# Altium schematic sheet Power_Burn_wire.SchDoc
size A4; SheetNumber: 1; SheetTotal: 2
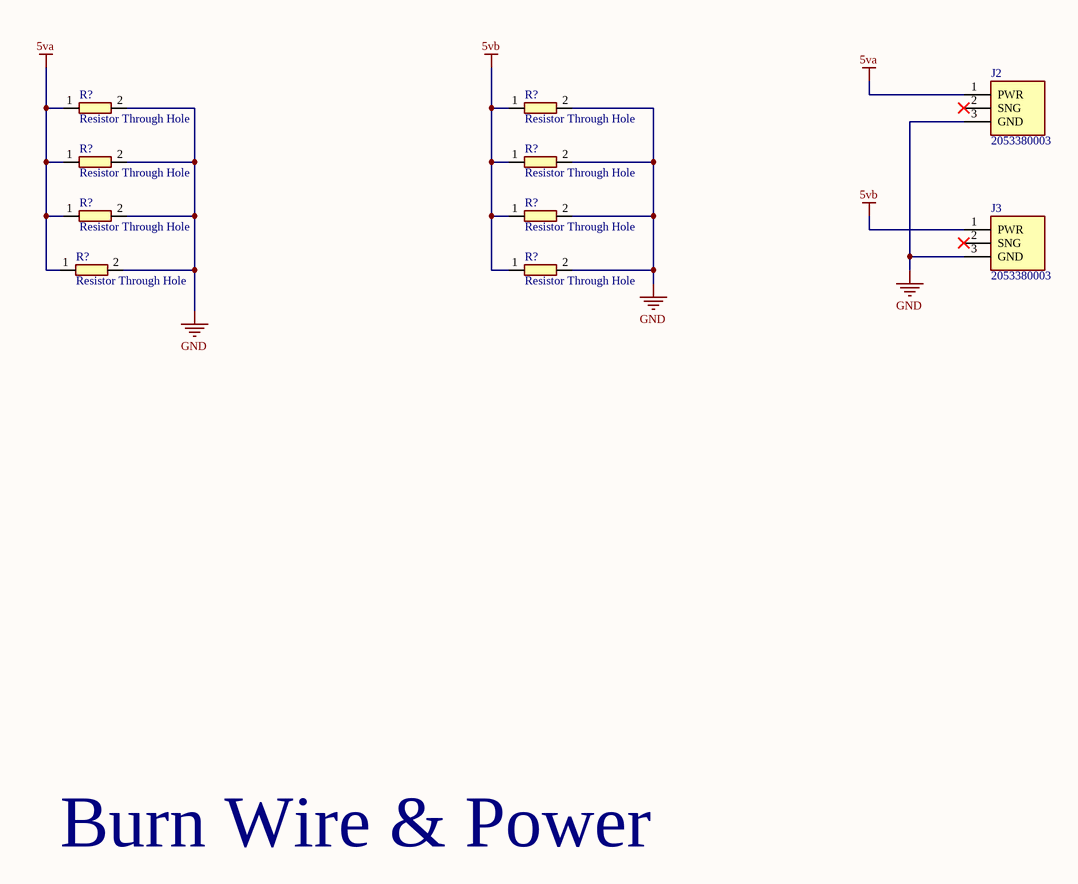
[diagram p0: Power_Burn_wire.SchDoc]

## Parts
(Parts that share a designator on the sheet are numbered #1, #2 ... from top to bottom, then left to right.)
J2  2053380003  [2053380003]
J3  2053380003  [2053380003]
R?#1  Resistor Through Hole  [ResistoR THROUGHHOLE]
R?#2  Resistor Through Hole  [ResistoR THROUGHHOLE]
R?#3  Resistor Through Hole  [ResistoR THROUGHHOLE]
R?#4  Resistor Through Hole  [ResistoR THROUGHHOLE]
R?#5  Resistor Through Hole  [ResistoR THROUGHHOLE]
R?#6  Resistor Through Hole  [ResistoR THROUGHHOLE]
R?#7  Resistor Through Hole  [ResistoR THROUGHHOLE]
R?#8  Resistor Through Hole  [ResistoR THROUGHHOLE]

## Nets
5va: J2.1(PWR) R?#1.1 R?#3.1 R?#5.1 R?#7.1
5vb: J3.1(PWR) R?#2.1 R?#4.1 R?#6.1 R?#8.1
GND: J2.3(GND) J3.3(GND) R?#1.2 R?#2.2 R?#3.2 R?#4.2 R?#5.2 R?#6.2 R?#7.2 R?#8.2

Not connected (* = marked no-connect by the designer): J2 2(SNG)*; J3 2(SNG)*

## Notes on the sheet
- Burn Wire & Power

## Library data of the parts
J2 J3 = 2053380003: Connector; Manufacturer_Name: Molex; Datasheet Link: https://www.molex.com/en-us/products/part-detail-pdf/2053380003?display=pdf; Height: 2.6mm; Manufacturer_Part_Number: 2053380003; Arrow Part Number: 2053380003; Arrow Price/Stock: https://www.arrow.com/en/products/2053380003/molex?utm_currency=USD&region=nac
R?#1-R?#8 = Resistor